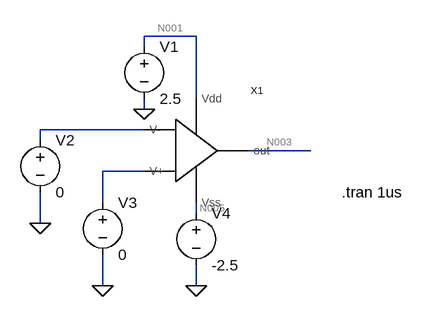
[diagram p0: schematic output_offset.asc]
output_offset.asc, the LTspice schematic file:
Version 4
SHEET 1 880 680
WIRE 128 -16 48 -16
WIRE 48 0 48 -16
WIRE 128 80 128 -16
WIRE 48 96 48 80
WIRE 48 128 -112 128
WIRE -112 144 -112 128
WIRE 304 160 208 160
WIRE 48 192 -16 192
WIRE -16 240 -16 192
WIRE 128 256 128 240
WIRE -112 272 -112 224
WIRE -16 368 -16 320
WIRE 128 368 128 336
FLAG -112 272 0
FLAG -16 368 0
FLAG 128 368 0
FLAG 48 96 0
SYMBOL voltage 48 -16 R0
WINDOW 123 0 0 Left 0
WINDOW 39 0 0 Left 0
SYMATTR InstName V1
SYMATTR Value 2.5
SYMBOL voltage -112 128 R0
WINDOW 123 0 0 Left 0
WINDOW 39 0 0 Left 0
SYMATTR InstName V2
SYMATTR Value 0
SYMBOL OPAMP 16 160 R0
SYMATTR InstName X1
SYMBOL voltage -16 224 R0
WINDOW 123 0 0 Left 0
WINDOW 39 0 0 Left 0
SYMATTR InstName V3
SYMATTR Value 0
SYMBOL voltage 128 240 R0
WINDOW 123 0 0 Left 0
WINDOW 39 0 0 Left 0
SYMATTR InstName V4
SYMATTR Value -2.5
TEXT 352 224 Left 2 !.tran 1us

The netlist it stands for:
* output_offset.asc
V1 N001 0 2.5
V2 N002 0 0
XX1 N001 N005 N002 N004 N003 OPAMP  ; pins Vdd Vss V- V+ out
V3 N004 0 0
V4 N005 0 -2.5
.tran 1us
.backanno
.end

* Results of the author's LTspice run, read from the files saved beside the schematic
* Operating Point, zero values left out:
*   V(n001) = 2.5 V
*   V(n005) = -2.5 V
*   V(n003) = 608.4 mV
*   I(V1) = -191.2 µA
*   I(V4) = 191.2 µA
*   Ix(x1:VDD) = 191.2 µA
*   Ix(x1:VSS) = -191.2 µA